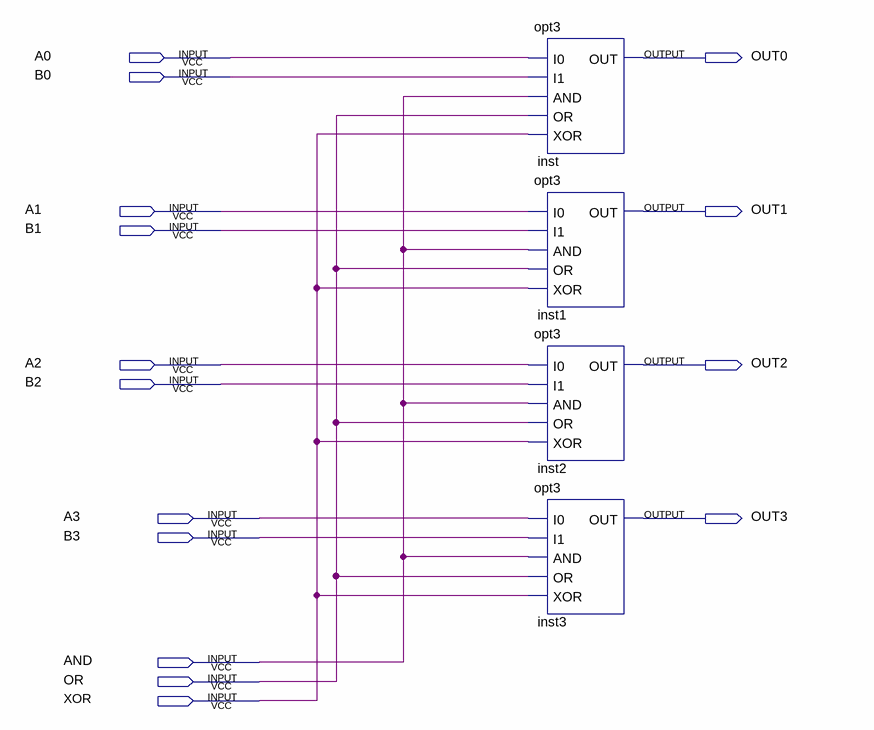
[diagram p0: schematic sheet]
// Quartus schematic 4opt3.bdf as structural Verilog: 4 symbols, 15 pins
module \4opt3  (
  input  A0,
  input  B0,
  input  A1,
  input  B1,
  input  A2,
  input  B2,
  input  A3,
  input  B3,
  input  AND,
  input  OR,
  input  XOR,
  output OUT0,
  output OUT1,
  output OUT2,
  output OUT3
);

  opt3 inst (.I0(A0), .I1(B0), .AND(AND), .OR(OR), .XOR(XOR), .OUT(OUT0));
  opt3 inst1 (.I0(A1), .I1(B1), .AND(AND), .OR(OR), .XOR(XOR), .OUT(OUT1));
  opt3 inst2 (.I0(A2), .I1(B2), .AND(AND), .OR(OR), .XOR(XOR), .OUT(OUT2));
  opt3 inst3 (.I0(A3), .I1(B3), .AND(AND), .OR(OR), .XOR(XOR), .OUT(OUT3));
endmodule
